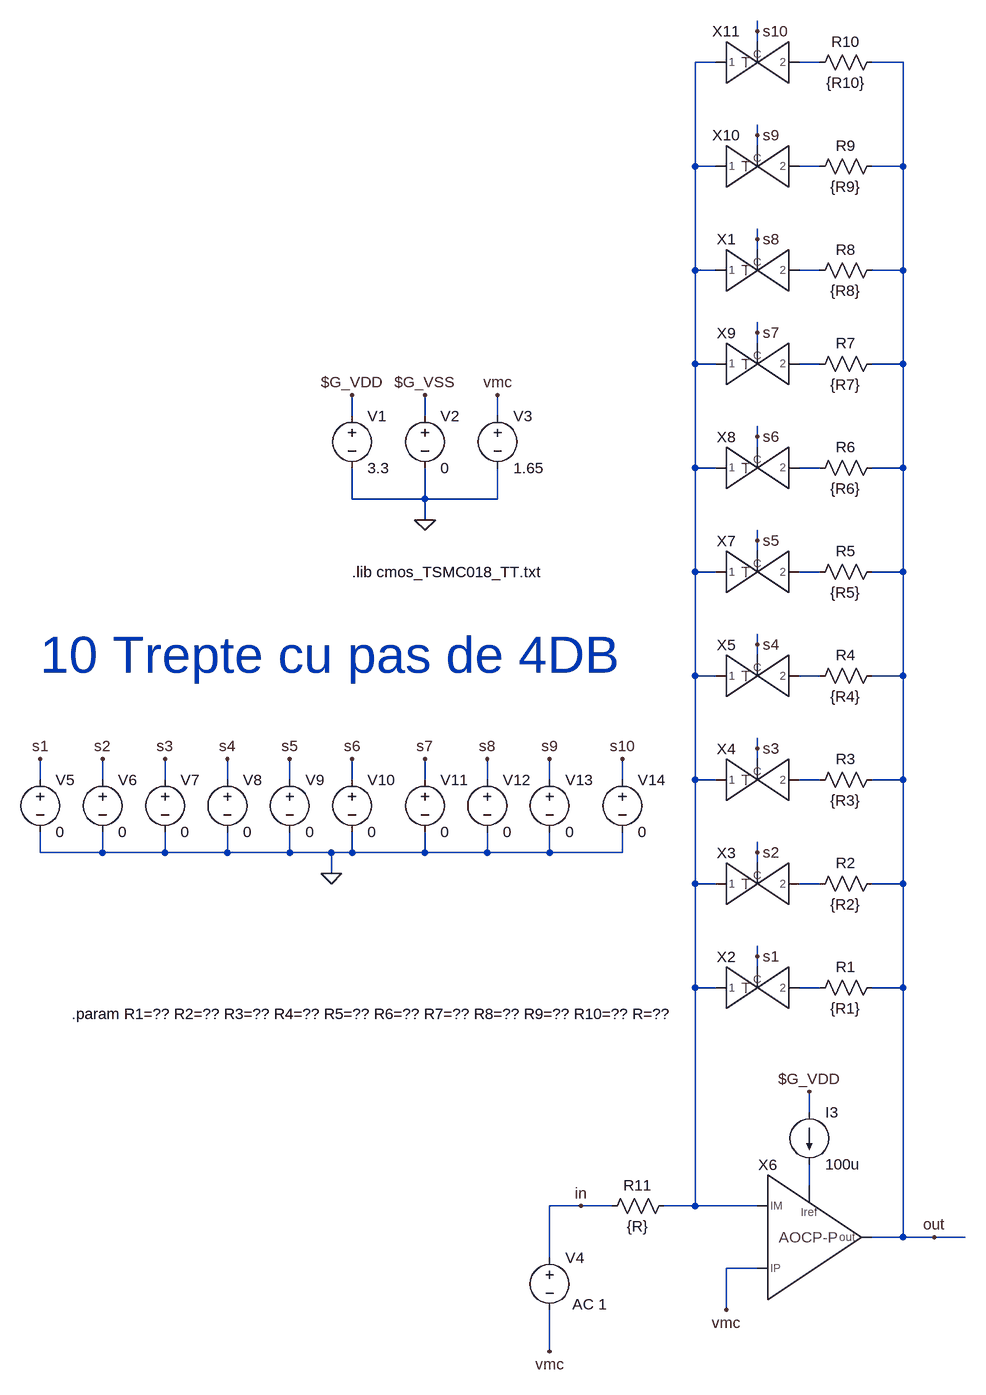
[diagram p0: schematic test_pga1.asc]
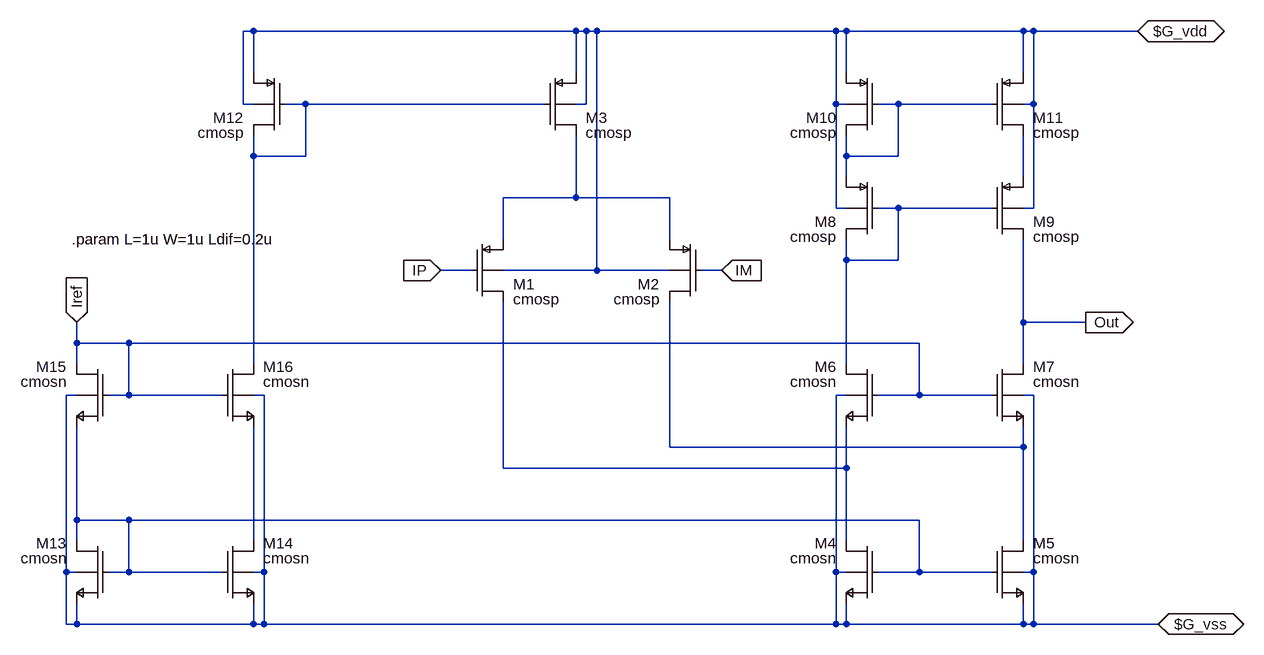
[diagram p1: sub-circuit ao_cp_p.asc]
test_pga1.asc, the LTspice schematic file:
Version 4
SHEET 1 2632 1328
WIRE 704 -976 704 -992
WIRE 704 -960 704 -976
WIRE 640 -928 608 -928
WIRE 800 -928 768 -928
WIRE 928 -928 880 -928
WIRE 704 -816 704 -832
WIRE 704 -800 704 -816
WIRE 608 -768 608 -928
WIRE 640 -768 608 -768
WIRE 800 -768 768 -768
WIRE 928 -768 928 -928
WIRE 928 -768 880 -768
WIRE 704 -656 704 -672
WIRE 704 -640 704 -656
WIRE 608 -608 608 -768
WIRE 640 -608 608 -608
WIRE 800 -608 768 -608
WIRE 928 -608 928 -768
WIRE 928 -608 880 -608
WIRE 704 -512 704 -528
WIRE 704 -496 704 -512
WIRE 608 -464 608 -608
WIRE 640 -464 608 -464
WIRE 800 -464 768 -464
WIRE 928 -464 928 -608
WIRE 928 -464 880 -464
WIRE 80 -384 80 -416
WIRE 192 -384 192 -416
WIRE 304 -384 304 -416
WIRE 704 -352 704 -368
WIRE 704 -336 704 -352
WIRE 608 -304 608 -464
WIRE 640 -304 608 -304
WIRE 800 -304 768 -304
WIRE 928 -304 928 -464
WIRE 928 -304 880 -304
WIRE 80 -256 80 -304
WIRE 192 -256 192 -304
WIRE 192 -256 80 -256
WIRE 304 -256 304 -304
WIRE 304 -256 192 -256
WIRE 192 -224 192 -256
WIRE 704 -192 704 -208
WIRE 704 -176 704 -192
WIRE 608 -144 608 -304
WIRE 640 -144 608 -144
WIRE 800 -144 768 -144
WIRE 928 -144 928 -304
WIRE 928 -144 880 -144
WIRE 704 -32 704 -48
WIRE 704 -16 704 -32
WIRE 608 16 608 -144
WIRE 640 16 608 16
WIRE 800 16 768 16
WIRE 928 16 928 -144
WIRE 928 16 880 16
WIRE 704 128 704 112
WIRE 704 144 704 128
WIRE -400 176 -400 144
WIRE -304 176 -304 144
WIRE -208 176 -208 144
WIRE -112 176 -112 144
WIRE -16 176 -16 144
WIRE 80 176 80 144
WIRE 192 176 192 144
WIRE 288 176 288 144
WIRE 384 176 384 144
WIRE 496 176 496 144
WIRE 608 176 608 16
WIRE 640 176 608 176
WIRE 800 176 768 176
WIRE 928 176 928 16
WIRE 928 176 880 176
WIRE -400 288 -400 256
WIRE -304 288 -304 256
WIRE -304 288 -400 288
WIRE -208 288 -208 256
WIRE -208 288 -304 288
WIRE -112 288 -112 256
WIRE -112 288 -208 288
WIRE -16 288 -16 256
WIRE -16 288 -112 288
WIRE 48 288 -16 288
WIRE 80 288 80 256
WIRE 80 288 48 288
WIRE 192 288 192 256
WIRE 192 288 80 288
WIRE 288 288 288 256
WIRE 288 288 192 288
WIRE 384 288 384 256
WIRE 384 288 288 288
WIRE 496 288 496 256
WIRE 496 288 384 288
WIRE 704 288 704 272
WIRE 704 304 704 288
WIRE 48 320 48 288
WIRE 608 336 608 176
WIRE 640 336 608 336
WIRE 800 336 768 336
WIRE 928 336 928 176
WIRE 928 336 880 336
WIRE 704 448 704 432
WIRE 704 464 704 448
WIRE 608 496 608 336
WIRE 640 496 608 496
WIRE 800 496 768 496
WIRE 928 496 928 336
WIRE 928 496 880 496
WIRE 784 688 784 656
WIRE 784 800 784 768
WIRE 432 832 384 832
WIRE 480 832 432 832
WIRE 608 832 608 496
WIRE 608 832 560 832
WIRE 704 832 608 832
WIRE 928 880 928 496
WIRE 928 880 880 880
WIRE 976 880 928 880
WIRE 1024 880 976 880
WIRE 384 912 384 832
WIRE 704 928 656 928
WIRE 656 992 656 928
WIRE 384 1056 384 992
FLAG 192 -224 0
FLAG 80 -416 $G_VDD
FLAG 192 -416 $G_VSS
FLAG 304 -416 vmc
FLAG 656 992 vmc
FLAG 976 880 out
FLAG 704 448 s1
FLAG 704 288 s2
FLAG 704 128 s3
FLAG 704 -32 s4
FLAG 704 -192 s5
FLAG 704 -352 s6
FLAG 704 -512 s7
FLAG -400 144 s1
FLAG 432 832 in
FLAG -304 144 s2
FLAG -208 144 s3
FLAG -112 144 s4
FLAG -16 144 s5
FLAG 80 144 s6
FLAG 48 320 0
FLAG 384 1056 vmc
FLAG 784 656 $G_VDD
FLAG 704 -656 s8
FLAG 704 -816 s9
FLAG 704 -976 s10
FLAG 192 144 s7
FLAG 288 144 s8
FLAG 384 144 s9
FLAG 496 144 s10
SYMBOL voltage 384 896 R0
WINDOW 3 33 130 Left 2
WINDOW 123 35 87 Left 2
WINDOW 39 0 0 Left 0
SYMATTR Value ""
SYMATTR Value2 AC 1
SYMATTR InstName V4
SYMBOL voltage 80 -400 R0
WINDOW 123 0 0 Left 2
WINDOW 39 0 0 Left 2
SYMATTR InstName V1
SYMATTR Value 3.3
SYMBOL voltage 192 -400 R0
WINDOW 123 0 0 Left 2
WINDOW 39 0 0 Left 2
SYMATTR InstName V2
SYMATTR Value 0
SYMBOL voltage 304 -400 R0
WINDOW 123 0 0 Left 2
WINDOW 39 0 0 Left 2
SYMATTR InstName V3
SYMATTR Value 1.65
SYMBOL current 784 688 R0
WINDOW 123 0 0 Left 0
WINDOW 39 0 0 Left 0
SYMATTR InstName I3
SYMATTR Value 100u
SYMBOL res 576 816 R90
WINDOW 0 0 56 VBottom 2
WINDOW 3 32 56 VTop 2
SYMATTR InstName R11
SYMATTR Value {R}
SYMBOL res 896 480 R90
WINDOW 0 0 56 VBottom 2
WINDOW 3 32 56 VTop 2
SYMATTR InstName R1
SYMATTR Value {R1}
SYMBOL com_tgate 720 496 R0
SYMATTR InstName X2
SYMBOL res 896 320 R90
WINDOW 0 0 56 VBottom 2
WINDOW 3 32 56 VTop 2
SYMATTR InstName R2
SYMATTR Value {R2}
SYMBOL com_tgate 720 336 R0
SYMATTR InstName X3
SYMBOL res 896 160 R90
WINDOW 0 0 56 VBottom 2
WINDOW 3 32 56 VTop 2
SYMATTR InstName R3
SYMATTR Value {R3}
SYMBOL com_tgate 720 176 R0
SYMATTR InstName X4
SYMBOL res 896 0 R90
WINDOW 0 0 56 VBottom 2
WINDOW 3 32 56 VTop 2
SYMATTR InstName R4
SYMATTR Value {R4}
SYMBOL com_tgate 720 16 R0
SYMATTR InstName X5
SYMBOL res 896 -160 R90
WINDOW 0 0 56 VBottom 2
WINDOW 3 32 56 VTop 2
SYMATTR InstName R5
SYMATTR Value {R5}
SYMBOL com_tgate 720 -144 R0
SYMATTR InstName X7
SYMBOL res 896 -320 R90
WINDOW 0 0 56 VBottom 2
WINDOW 3 32 56 VTop 2
SYMATTR InstName R6
SYMATTR Value {R6}
SYMBOL com_tgate 720 -304 R0
SYMATTR InstName X8
SYMBOL res 896 -480 R90
WINDOW 0 0 56 VBottom 2
WINDOW 3 32 56 VTop 2
SYMATTR InstName R7
SYMATTR Value {R7}
SYMBOL com_tgate 720 -464 R0
SYMATTR InstName X9
SYMBOL voltage -400 160 R0
WINDOW 123 0 0 Left 0
WINDOW 39 0 0 Left 0
SYMATTR InstName V5
SYMATTR Value 0
SYMBOL voltage -304 160 R0
WINDOW 123 0 0 Left 0
WINDOW 39 0 0 Left 0
SYMATTR InstName V6
SYMATTR Value 0
SYMBOL voltage -208 160 R0
WINDOW 123 0 0 Left 0
WINDOW 39 0 0 Left 0
SYMATTR InstName V7
SYMATTR Value 0
SYMBOL voltage -112 160 R0
WINDOW 123 0 0 Left 0
WINDOW 39 0 0 Left 0
SYMATTR InstName V8
SYMATTR Value 0
SYMBOL voltage -16 160 R0
WINDOW 123 0 0 Left 0
WINDOW 39 0 0 Left 0
SYMATTR InstName V9
SYMATTR Value 0
SYMBOL voltage 80 160 R0
WINDOW 123 0 0 Left 0
WINDOW 39 0 0 Left 0
SYMATTR InstName V10
SYMATTR Value 0
SYMBOL ao_cp_p 752 880 R0
SYMATTR InstName X6
SYMBOL res 896 -624 R90
WINDOW 0 0 56 VBottom 2
WINDOW 3 32 56 VTop 2
SYMATTR InstName R8
SYMATTR Value {R8}
SYMBOL com_tgate 720 -608 R0
SYMATTR InstName X1
SYMBOL res 896 -784 R90
WINDOW 0 0 56 VBottom 2
WINDOW 3 32 56 VTop 2
SYMATTR InstName R9
SYMATTR Value {R9}
SYMBOL com_tgate 720 -768 R0
SYMATTR InstName X10
SYMBOL res 896 -944 R90
WINDOW 0 0 56 VBottom 2
WINDOW 3 32 56 VTop 2
SYMATTR InstName R10
SYMATTR Value {R10}
SYMBOL com_tgate 720 -928 R0
SYMATTR InstName X11
SYMBOL voltage 192 160 R0
WINDOW 123 0 0 Left 0
WINDOW 39 0 0 Left 0
SYMATTR InstName V11
SYMATTR Value 0
SYMBOL voltage 288 160 R0
WINDOW 123 0 0 Left 0
WINDOW 39 0 0 Left 0
SYMATTR InstName V12
SYMATTR Value 0
SYMBOL voltage 384 160 R0
WINDOW 123 0 0 Left 0
WINDOW 39 0 0 Left 0
SYMATTR InstName V13
SYMATTR Value 0
SYMBOL voltage 496 160 R0
WINDOW 123 0 0 Left 0
WINDOW 39 0 0 Left 0
SYMATTR InstName V14
SYMATTR Value 0
TEXT 80 -144 Left 2 !.lib cmos_TSMC018_TT.txt
TEXT -352 536 Left 2 !.param R1=?? R2=?? R3=?? R4=?? R5=?? R6=?? R7=?? R8=?? R9=?? R10=?? R=??
TEXT -400 -16 Left 6 ;10 Trepte cu pas de 4DB

ao_cp_p.asc, the sub-circuit schematic file:
Version 4
SHEET 1 2836 1240
WIRE 512 -432 496 -432
WIRE 1008 -432 512 -432
WIRE 1024 -432 1008 -432
WIRE 1040 -432 1024 -432
WIRE 1408 -432 1040 -432
WIRE 1424 -432 1408 -432
WIRE 1696 -432 1424 -432
WIRE 1712 -432 1696 -432
WIRE 1872 -432 1712 -432
WIRE 512 -368 512 -432
WIRE 1008 -368 1008 -432
WIRE 1424 -368 1424 -432
WIRE 1696 -368 1696 -432
WIRE 496 -320 496 -432
WIRE 512 -320 496 -320
WIRE 592 -320 560 -320
WIRE 960 -320 592 -320
WIRE 1024 -320 1024 -432
WIRE 1024 -320 1008 -320
WIRE 1408 -320 1408 -432
WIRE 1424 -320 1408 -320
WIRE 1504 -320 1472 -320
WIRE 1648 -320 1504 -320
WIRE 1712 -320 1712 -432
WIRE 1712 -320 1696 -320
WIRE 512 -240 512 -272
WIRE 592 -240 592 -320
WIRE 592 -240 512 -240
WIRE 1424 -240 1424 -272
WIRE 1504 -240 1504 -320
WIRE 1504 -240 1424 -240
WIRE 1424 -208 1424 -240
WIRE 1696 -208 1696 -272
WIRE 1008 -176 1008 -272
WIRE 1008 -176 896 -176
WIRE 1152 -176 1008 -176
WIRE 1408 -160 1408 -320
WIRE 1424 -160 1408 -160
WIRE 1504 -160 1472 -160
WIRE 1648 -160 1504 -160
WIRE 1712 -160 1712 -320
WIRE 1712 -160 1696 -160
WIRE 896 -112 896 -176
WIRE 1152 -112 1152 -176
WIRE 1424 -80 1424 -112
WIRE 1504 -80 1504 -160
WIRE 1504 -80 1424 -80
WIRE 848 -64 800 -64
WIRE 1040 -64 1040 -432
WIRE 1040 -64 896 -64
WIRE 1152 -64 1040 -64
WIRE 1232 -64 1200 -64
WIRE 1696 16 1696 -112
WIRE 1792 16 1696 16
WIRE 240 48 240 16
WIRE 320 48 240 48
WIRE 1536 48 320 48
WIRE 240 80 240 48
WIRE 512 80 512 -240
WIRE 1424 80 1424 -80
WIRE 1696 80 1696 16
WIRE 240 128 224 128
WIRE 320 128 320 48
WIRE 320 128 288 128
WIRE 464 128 320 128
WIRE 528 128 512 128
WIRE 1424 128 1408 128
WIRE 1536 128 1536 48
WIRE 1536 128 1472 128
WIRE 1648 128 1536 128
WIRE 1712 128 1696 128
WIRE 1152 208 1152 -16
WIRE 1696 208 1696 176
WIRE 1696 208 1152 208
WIRE 896 240 896 -16
WIRE 1424 240 1424 176
WIRE 1424 240 896 240
WIRE 240 320 240 176
WIRE 320 320 240 320
WIRE 1536 320 320 320
WIRE 240 352 240 320
WIRE 512 352 512 176
WIRE 1424 352 1424 240
WIRE 1696 352 1696 208
WIRE 224 400 224 128
WIRE 240 400 224 400
WIRE 320 400 320 320
WIRE 320 400 288 400
WIRE 464 400 320 400
WIRE 528 400 528 128
WIRE 528 400 512 400
WIRE 1408 400 1408 128
WIRE 1424 400 1408 400
WIRE 1536 400 1536 320
WIRE 1536 400 1472 400
WIRE 1648 400 1536 400
WIRE 1712 400 1712 128
WIRE 1712 400 1696 400
WIRE 224 480 224 400
WIRE 240 480 240 448
WIRE 240 480 224 480
WIRE 512 480 512 448
WIRE 512 480 240 480
WIRE 528 480 528 400
WIRE 528 480 512 480
WIRE 1408 480 1408 400
WIRE 1408 480 528 480
WIRE 1424 480 1424 448
WIRE 1424 480 1408 480
WIRE 1696 480 1696 448
WIRE 1696 480 1424 480
WIRE 1712 480 1712 400
WIRE 1712 480 1696 480
WIRE 1904 480 1712 480
FLAG 800 -64 IP
IOPIN 800 -64 In
FLAG 1792 16 Out
IOPIN 1792 16 Out
FLAG 1232 -64 IM
IOPIN 1232 -64 In
FLAG 1872 -432 $G_vdd
IOPIN 1872 -432 BiDir
FLAG 1904 480 $G_vss
IOPIN 1904 480 BiDir
FLAG 240 16 Iref
IOPIN 240 16 In
SYMBOL pmosb 848 -112 R0
SYMATTR InstName M1
SYMATTR Value cmosp
SYMATTR Value2 l={L} w={W} ad={Ldif*W} as={Ldif*W} pd={(Ldif+W)*2} ps={(Ldif+W)*2} m=120
SYMBOL pmosb 1200 -112 M0
SYMATTR InstName M2
SYMATTR Value cmosp
SYMATTR Value2 l={L} w={W} ad={Ldif*W} as={Ldif*W} pd={(Ldif+W)*2} ps={(Ldif+W)*2} m=120
SYMBOL pmosb 960 -368 R0
SYMATTR InstName M3
SYMATTR Value cmosp
SYMATTR Value2 l={L} w={W} ad={Ldif*W} as={Ldif*W} pd={(Ldif+W)*2} ps={(Ldif+W)*2} m=152
SYMBOL nmosb 1472 352 M0
SYMATTR InstName M4
SYMATTR Value cmosn
SYMATTR Value2 l={L} w={W} ad={Ldif*W} as={Ldif*W} pd={(Ldif+W)*2} ps={(Ldif+W)*2} m=39.7
SYMBOL nmosb 1648 352 R0
SYMATTR InstName M5
SYMATTR Value cmosn
SYMATTR Value2 l={L} w={W} ad={Ldif*W} as={Ldif*W} pd={(Ldif+W)*2} ps={(Ldif+W)*2} m=39.7
SYMBOL nmosb 1472 80 M0
SYMATTR InstName M6
SYMATTR Value cmosn
SYMATTR Value2 l={L} w={W} ad={Ldif*W} as={Ldif*W} pd={(Ldif+W)*2} ps={(Ldif+W)*2} m=23.8
SYMBOL nmosb 1648 80 R0
SYMATTR InstName M7
SYMATTR Value cmosn
SYMATTR Value2 l={L} w={W} ad={Ldif*W} as={Ldif*W} pd={(Ldif+W)*2} ps={(Ldif+W)*2} m=23.8
SYMBOL pmosb 1472 -208 M0
SYMATTR InstName M8
SYMATTR Value cmosp
SYMATTR Value2 l={L} w={W} ad={Ldif*W} as={Ldif*W} pd={(Ldif+W)*2} ps={(Ldif+W)*2} m=114
SYMBOL pmosb 1648 -208 R0
SYMATTR InstName M9
SYMATTR Value cmosp
SYMATTR Value2 l={L} w={W} ad={Ldif*W} as={Ldif*W} pd={(Ldif+W)*2} ps={(Ldif+W)*2} m=114
SYMBOL pmosb 1472 -368 M0
SYMATTR InstName M10
SYMATTR Value cmosp
SYMATTR Value2 l={L} w={W} ad={Ldif*W} as={Ldif*W} pd={(Ldif+W)*2} ps={(Ldif+W)*2} m=114
SYMBOL pmosb 1648 -368 R0
SYMATTR InstName M11
SYMATTR Value cmosp
SYMATTR Value2 l={L} w={W} ad={Ldif*W} as={Ldif*W} pd={(Ldif+W)*2} ps={(Ldif+W)*2} m=114
SYMBOL pmosb 560 -368 M0
SYMATTR InstName M12
SYMATTR Value cmosp
SYMATTR Value2 l={L} w={W} ad={Ldif*W} as={Ldif*W} pd={(Ldif+W)*2} ps={(Ldif+W)*2} m=56.2
SYMBOL nmosb 288 352 M0
SYMATTR InstName M13
SYMATTR Value cmosn
SYMATTR Value2 l={L} w={W} ad={Ldif*W} as={Ldif*W} pd={(Ldif+W)*2} ps={(Ldif+W)*2} m=11.8
SYMBOL nmosb 464 352 R0
SYMATTR InstName M14
SYMATTR Value cmosn
SYMATTR Value2 l={L} w={W} ad={Ldif*W} as={Ldif*W} pd={(Ldif+W)*2} ps={(Ldif+W)*2} m=11.8
SYMBOL nmosb 288 80 M0
SYMATTR InstName M15
SYMATTR Value cmosn
SYMATTR Value2 l={L} w={W} ad={Ldif*W} as={Ldif*W} pd={(Ldif+W)*2} ps={(Ldif+W)*2} m=11.8
SYMBOL nmosb 464 80 R0
SYMATTR InstName M16
SYMATTR Value cmosn
SYMATTR Value2 l={L} w={W} ad={Ldif*W} as={Ldif*W} pd={(Ldif+W)*2} ps={(Ldif+W)*2} m=11.8
TEXT 232 -112 Left 2 !.param L=1u W=1u Ldif=0.2u

The netlist it stands for:
* test_pga1.asc
V4 in vmc AC 1
V1 $G_VDD 0 3.3
V2 $G_VSS 0 0
V3 vmc 0 1.65
I3 $G_VDD N012 100u
R11 N001 in {R}
R1 out N011 {R1}
XX2 N001 s1 N011 com_tgate  ; pins 1 C 2
R2 out N010 {R2}
XX3 N001 s2 N010 com_tgate  ; pins 1 C 2
R3 out N009 {R3}
XX4 N001 s3 N009 com_tgate  ; pins 1 C 2
R4 out N008 {R4}
XX5 N001 s4 N008 com_tgate  ; pins 1 C 2
R5 out N007 {R5}
XX7 N001 s5 N007 com_tgate  ; pins 1 C 2
R6 out N006 {R6}
XX8 N001 s6 N006 com_tgate  ; pins 1 C 2
R7 out N005 {R7}
XX9 N001 s7 N005 com_tgate  ; pins 1 C 2
V5 s1 0 0
V6 s2 0 0
V7 s3 0 0
V8 s4 0 0
V9 s5 0 0
V10 s6 0 0
XX6 N001 vmc out N012 ao_cp_p
R8 out N004 {R8}
XX1 N001 s8 N004 com_tgate  ; pins 1 C 2
R9 out N003 {R9}
XX10 N001 s9 N003 com_tgate  ; pins 1 C 2
R10 out N002 {R10}
XX11 N001 s10 N002 com_tgate  ; pins 1 C 2
V11 s7 0 0
V12 s8 0 0
V13 s9 0 0
V14 s10 0 0

* block symbol definitions
.subckt ao_cp_p IM IP out Iref
M1 N007 IP N004 $G_vdd cmosp l={L} w={W} ad={Ldif*W} as={Ldif*W} pd={(Ldif+W)*2} ps={(Ldif+W)*2} m=120
M2 N006 IM N004 $G_vdd cmosp l={L} w={W} ad={Ldif*W} as={Ldif*W} pd={(Ldif+W)*2} ps={(Ldif+W)*2} m=120
M3 N004 N001 $G_vdd $G_vdd cmosp l={L} w={W} ad={Ldif*W} as={Ldif*W} pd={(Ldif+W)*2} ps={(Ldif+W)*2} m=152
M4 N007 N008 $G_vss $G_vss cmosn l={L} w={W} ad={Ldif*W} as={Ldif*W} pd={(Ldif+W)*2} ps={(Ldif+W)*2} m=39.7
M5 N006 N008 $G_vss $G_vss cmosn l={L} w={W} ad={Ldif*W} as={Ldif*W} pd={(Ldif+W)*2} ps={(Ldif+W)*2} m=39.7
M6 N005 Iref N007 $G_vss cmosn l={L} w={W} ad={Ldif*W} as={Ldif*W} pd={(Ldif+W)*2} ps={(Ldif+W)*2} m=23.8
M7 Out Iref N006 $G_vss cmosn l={L} w={W} ad={Ldif*W} as={Ldif*W} pd={(Ldif+W)*2} ps={(Ldif+W)*2} m=23.8
M8 N005 N005 N002 $G_vdd cmosp l={L} w={W} ad={Ldif*W} as={Ldif*W} pd={(Ldif+W)*2} ps={(Ldif+W)*2} m=114
M9 Out N005 N003 $G_vdd cmosp l={L} w={W} ad={Ldif*W} as={Ldif*W} pd={(Ldif+W)*2} ps={(Ldif+W)*2} m=114
M10 N002 N002 $G_vdd $G_vdd cmosp l={L} w={W} ad={Ldif*W} as={Ldif*W} pd={(Ldif+W)*2} ps={(Ldif+W)*2} m=114
M11 N003 N002 $G_vdd $G_vdd cmosp l={L} w={W} ad={Ldif*W} as={Ldif*W} pd={(Ldif+W)*2} ps={(Ldif+W)*2} m=114
M12 N001 N001 $G_vdd $G_vdd cmosp l={L} w={W} ad={Ldif*W} as={Ldif*W} pd={(Ldif+W)*2} ps={(Ldif+W)*2} m=56.2
M13 N008 N008 $G_vss $G_vss cmosn l={L} w={W} ad={Ldif*W} as={Ldif*W} pd={(Ldif+W)*2} ps={(Ldif+W)*2} m=11.8
M14 N009 N008 $G_vss $G_vss cmosn l={L} w={W} ad={Ldif*W} as={Ldif*W} pd={(Ldif+W)*2} ps={(Ldif+W)*2} m=11.8
M15 Iref Iref N008 $G_vss cmosn l={L} w={W} ad={Ldif*W} as={Ldif*W} pd={(Ldif+W)*2} ps={(Ldif+W)*2} m=11.8
M16 N001 Iref N009 $G_vss cmosn l={L} w={W} ad={Ldif*W} as={Ldif*W} pd={(Ldif+W)*2} ps={(Ldif+W)*2} m=11.8
.param L=1u W=1u Ldif=0.2u
.ends ao_cp_p

.model NMOS NMOS
.model PMOS PMOS
.lib standard.mos
.lib cmos_TSMC018_TT.txt
.param R1=?? R2=?? R3=?? R4=?? R5=?? R6=?? R7=?? R8=?? R9=?? R10=?? R=??
* 10 Trepte cu pas de 4DB
.backanno
.end